# Altium schematic sheet RS485.SchDoc
size A; SheetNumber: 5; SheetTotal: 7
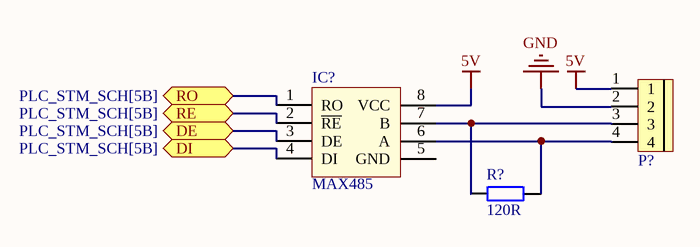
[diagram p0: RS485.SchDoc]

## Parts
IC?  MAX485  [SO8]
P?  CON 4 EDG5.08  [CON 4 4EDG5.08]  (value not drawn)
R?  120R  [tro smd 0805]

## Ports
DE (bidir, see PLC_STM_SCH[5B]), DI (bidir, see PLC_STM_SCH[5B]), RE (bidir, see PLC_STM_SCH[5B]), RO (bidir, see PLC_STM_SCH[5B])

## Nets
5V: IC?.8(VCC) P?.1
GND: P?.2
DE: IC?.3(DE) ; port DE
DI: IC?.4(DI) ; port DI
RE: IC?.2(~{RE}) ; port RE
RO: IC?.1(RO) ; port RO
NetIC?_6: IC?.6(A) P?.4 R?.1
NetIC?_7: IC?.7(B) P?.3 R?.2

Not connected (* = marked no-connect by the designer): IC? 5(GND)

## Library data of the parts
IC? = MAX485: RS232 - RS485 (Same sn75176)
P? = CON 4 EDG5.08: Cắm; Ten_Linh_Kien: CON 4 2EDG5.08-4P 5.08MM ( Xanh Cong); Ma_Hang: MH000979; Don_Vi: Con; Ghi_Chu: *; Kieu_Chan: *; Chung_Loai: Cắm
R? = Tro 0805 5% 120R: Dán; Don_Vi: Con; So_Chan: 2; Ten_Linh_Kien: Trở 0805 5% 120R; Ma_Hang: MH005253; Chung_Loai: Dán; Kieu_Chan: *